# Altium project medusa-AI.PrjPCB
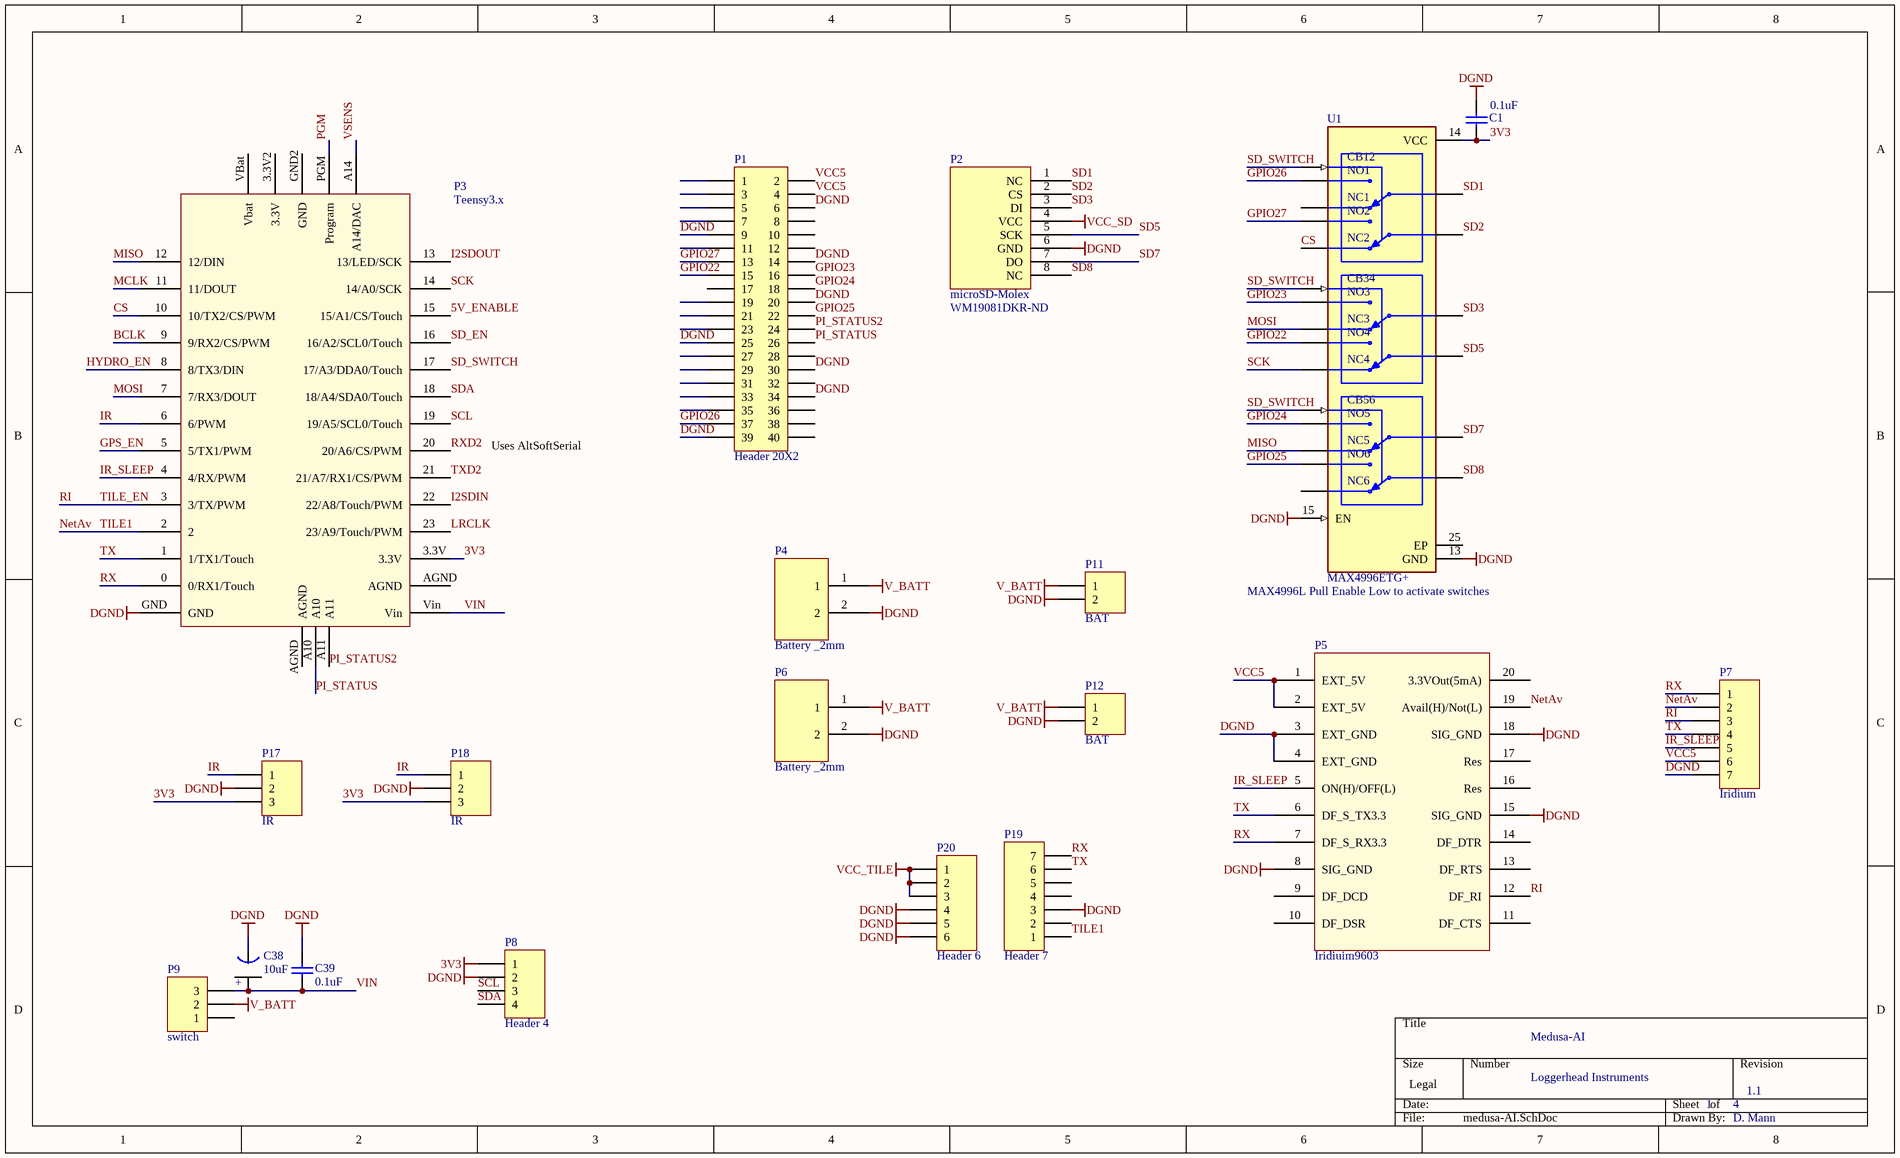
[diagram p0: medusa-AI.SchDoc]
4 sheets, 75 parts. Net scope: global (net labels, ports and power ports of the same name join across sheets).
Board file: medusa-AI.PcbDoc
Sheets:
  medusa-AI.SchDoc
  medusa-AI-audio.SchDoc
  medusa-AI-sensors.SchDoc
  medusa-AI-power.SchDoc

## Sheet medusa-AI.SchDoc
size Legal

### Parts
C1  0.1uF  [0402]
C38  10uF  [Tant0805]
C39  0.1uF  [0402]
P1  Header 20X2  [HDR2X20]
P2  microSD-Molex  Supplier Part Number 1: WM19081DKR-ND  [microSD_Molex_hinged]
P3  Teensy3.x  [Teensy3.x]
P4  Battery _2mm  [HDR_2x1_2mm]
P5  Iridiuim9603  [Iridium9603]
P6  Battery _2mm  [HDR_2x1_2mm]
P7  Iridium  [HDR1X7]
P8  Header 4  [HDR1X4]
P9  switch  [HDR1X3]
P11  BAT  [HDR1X2]
P12  BAT  [HDR1X2]
P17  IR  [HDR1X3]
P18  IR  [HDR1X3]
P19  Header 7  [HDR1X7]
P20  Header 6  [HDR1X6]
U1  MAX4996ETG+  [QFN40P350X350X80-25N]

### Nets
3V3: C1.1 P3.3.3V P8.1 P17.3 P18.3 U1.14(VCC)
DGND: C1.2 C38.1(GND) C39.2 P1.6 P1.9 P1.14 P1.20 P1.25 P1.30 P1.34 P1.39 P2.6(GND) P3.GND P4.2 P5.3(EXT_GND) P5.4(EXT_GND) P5.8(SIG_GND) P5.15(SIG_GND) P5.18(SIG_GND) P6.2 P7.7 P8.2 P11.2 P12.2 P17.2 P18.2 P19.3 P20.4 P20.5 P20.6 U1.13(GND) U1.15(EN)
V_BATT: P4.1 P6.1 P9.2 P11.1 P12.1
VCC_SD: P2.4(VCC)
VCC_TILE: P20.1 P20.2 P20.3
VIN: C38.2(+) C39.1 P3.Vin P9.3
5V_ENABLE: P3.15(15/A1/CS/Touch)
BCLK: P3.9(9/RX2/CS/PWM)
CS: P3.10(10/TX2/CS/PWM) U1.11(NC2)
GPIO22: P1.15 U1.22(NO4)
GPIO23: P1.16 U1.21(NO3)
GPIO24: P1.18 U1.23(NO5)
GPIO25: P1.22 U1.24(NO6)
GPIO26: P1.37 U1.19(NO1)
GPIO27: P1.13 U1.20(NO2)
GPS_EN: P3.5(5/TX1/PWM)
HYDRO_EN: P3.8(8/TX3/DIN)
I2SDIN: P3.22(22/A8/Touch/PWM)
I2SDOUT: P3.13(13/LED/SCK)
IR: P3.6(6/PWM) P17.1 P18.1
IR_SLEEP: P3.4(4/RX/PWM) P5.5(ON(H)/OFF(L)) P7.5
LRCLK: P3.23(23/A9/Touch/PWM)
MCLK: P3.11(11/DOUT)
MISO: P3.12(12/DIN) U1.8(NC5)
MOSI: P3.7(7/RX3/DOUT) U1.10(NC3)
NetAv: P3.2 P5.19(Avail(H)/Not(L)) P7.2 P19.1  [also labelled TILE1]
PGM: P3.PGM(Program)
PI_STATUS: P1.26 P3.A10
PI_STATUS2: P1.24 P3.A11
RI: P3.3(3/TX/PWM) P5.12(DF_RI) P7.3  [also labelled TILE_EN]
RX: P3.0(0/RX1/Touch) P5.7(DF_S_RX3.3) P7.1 P19.7
RXD2: P3.20(20/A6/CS/PWM)
SCK: P3.14(14/A0/SCK) U1.9(NC4)
SCL: P3.19(19/A5/SCL0/Touch) P8.3
SD1: P2.1(NC) U1.18(COM1)
SD2: P2.2(CS) U1.17(COM2)
SD3: P2.3(DI) U1.16(COM3)
SD5: P2.5(SCK) U1.4(COM4)
SD7: P2.7(DO) U1.5(COM5)
SD8: P2.8(NC) U1.6(COM6)
SD_EN: P3.16(16/A2/SCL0/Touch)
SD_SWITCH: P3.17(17/A3/DDA0/Touch) U1.1(CB12) U1.2(CB34) U1.3(CB56)
SDA: P3.18(18/A4/SDA0/Touch) P8.4
TX: P3.1(1/TX1/Touch) P5.6(DF_S_TX3.3) P7.4 P19.6
TXD2: P3.21(21/A7/RX1/CS/PWM)
VCC5: P1.2 P1.4 P5.1(EXT_5V) P5.2(EXT_5V) P7.6
VSENS: P3.A14(A14/DAC)

Not connected (* = marked no-connect by the designer): P1 1 3 5 7 8 10 11 12 17 19 21 23 27 28 29 31 32 33 35 36 38 40; P3 3.3V2(3.3V) AGND GND2(GND) VBat(Vbat); P5 9(DF_DCD) 10(DF_DSR) 11(DF_CTS) 13(DF_RTS) 14(DF_DTR) 16(Res) 17(Res) 20(3.3VOut(5mA)); P9 1; P19 2 4 5; U1 7(NC6) 12(NC1) 25(EP)

### Notes on the sheet
- Uses AltSoftSerial
- (near U1) MAX4996L Pull Enable Low to activate switches
- Medusa-AI
- Loggerhead Instruments
- 1
- 4
- 1.1
- D. Mann

### Library data of the parts
C1 C39 = C0402: Ceramic Chip Capacitor - Standard; Note: Footprint corresponds to dimensions for bulk cassette packaging. This case size has tightened tolerances.; Published: 17-Jul-2002; LatestRevisionDate: 19-Mar-2004; LatestRevisionNote: Silkscreen size reduced.; DatasheetDocument: Mar-2001; PackageDocument: Mar-2001; PackageReference: 0402; Publisher: Altium Limited; Code_JEITA: 0402; Code_IPC: 1005 [0402]; ComponentLink1Description: Manufacturer Link; ComponentLink1URL: http://www.kemet.com/; ComponentLink2Description: Datasheet; ComponentLink2URL: http://www.kemet.com/kemet/web/homepage/kechome.nsf/vapubfilesname/F3102TA.pdf/$file/F3102TA.pdf; Value: 0.1uF
C38 = Tant0805: Value: 10uF
P1 = Header 20X2: Header, 20-Pin, Dual row; LatestRevisionDate: 17-Jul-2002; LatestRevisionNote: Re-released for DXP Platform.; Publisher: Altium Limited
P2 = microSD_Molex_hinged: Supplier 1: Digi-Key
P4 P6 = HDR_2x1_2mm: Charging Connector
P5 = IRIDIUM9603
P7 P19 = Header 7: Header, 7-Pin; LatestRevisionDate: 17-Jul-2002; LatestRevisionNote: Re-released for DXP Platform.; Publisher: Altium Limited
P8 = Header 4: Header, 4-Pin; LatestRevisionDate: 17-Jul-2002; LatestRevisionNote: Re-released for DXP Platform.; Publisher: Altium Limited
P9 P17 P18 = Header 3: Header, 3-Pin; LatestRevisionDate: 17-Jul-2002; LatestRevisionNote: Re-released for DXP Platform.; Publisher: Altium Limited
P11 P12 = Header 2: Header, 2-Pin; LatestRevisionDate: 17-Jul-2002; LatestRevisionNote: Re-released for DXP Platform.; Publisher: Altium Limited
P20 = Header 6: Header, 6-Pin; LatestRevisionDate: 17-Jul-2002; LatestRevisionNote: Re-released for DXP Platform.; Publisher: Altium Limited
U1 = MAX4996ETG+: 3 Circuit IC Switch 2:2 4Ohm 24-TQFN (4x4); MF: Maxim Integrated; SnapEDA_Link: https://www.snapeda.com/parts/MAX4996ETG+/Maxim%20Integrated/view-part/1193961/?ref=snap; Value: *; Purchase-URL: https://pricing.snapeda.com/search/part/MAX4996ETG+/?ref=eda; Price: None; Availability: Warning; Check_prices: https://www.snapeda.com/parts/MAX4996ETG+/Maxim%20Integrated/view-part/1193961/?ref=eda; MP: MAX4996ETG+; Package: TQFN-24 Maxim

## Sheet medusa-AI-audio.SchDoc
size A
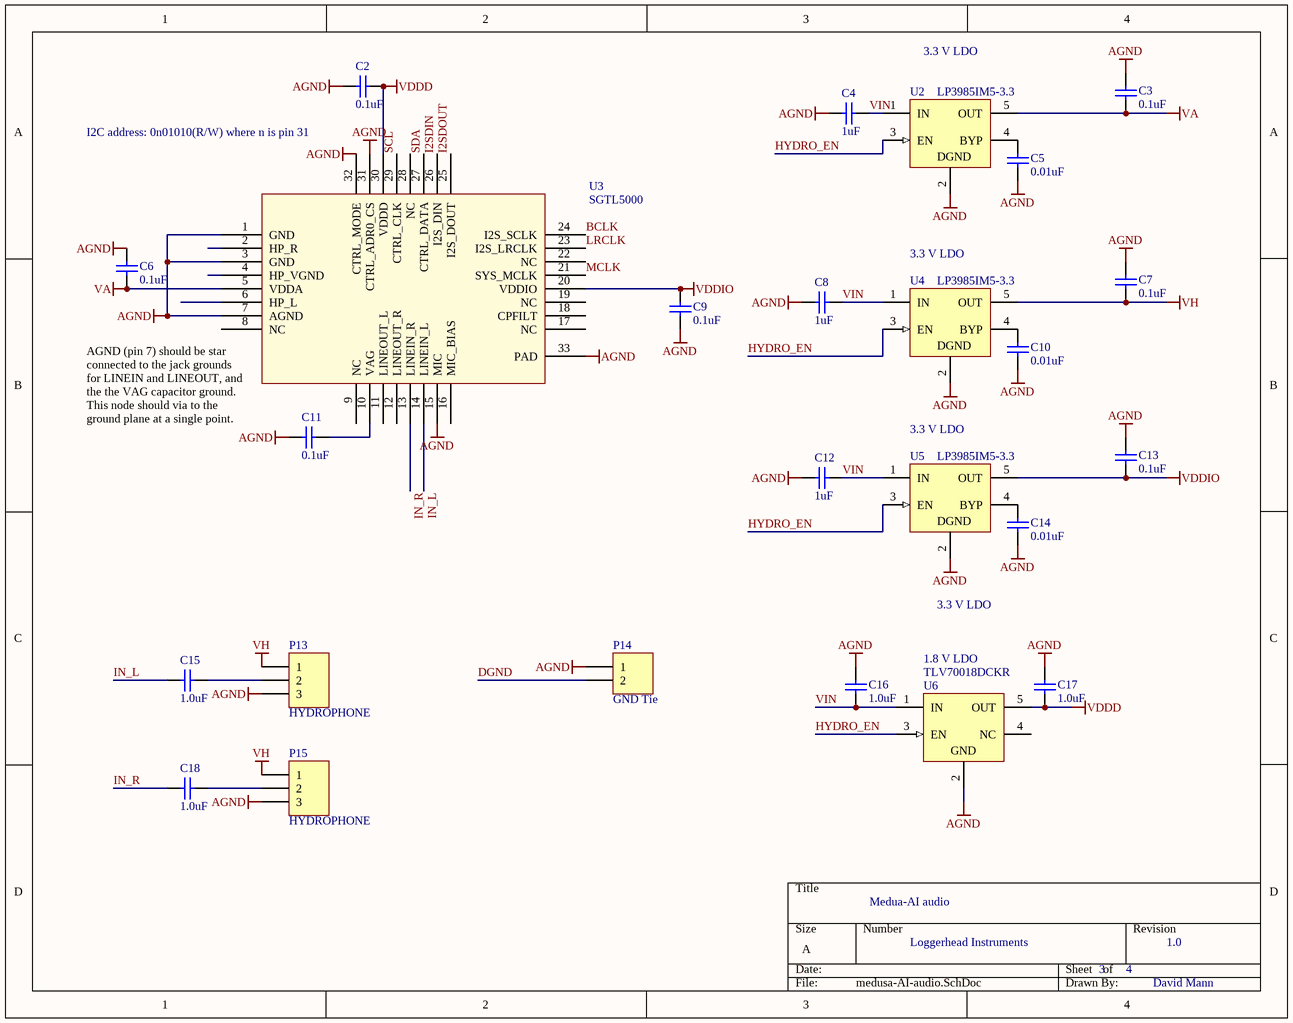
[diagram p1: medusa-AI-audio.SchDoc]

### Parts
C2  0.1uF  [0402]
C3  0.1uF  [0402]
C4  1uF  [0402]
C5  0.01uF  [0402]
C6  0.1uF  [0402]
C7  0.1uF  [0402]
C8  1uF  [0402]
C9  0.1uF  [0402]
C10  0.01uF  [0402]
C11  0.1uF  [0402]
C12  1uF  [0402]
C13  0.1uF  [0402]
C14  0.01uF  [0402]
C15  1.0uF  [0402]
C16  1.0uF  [0402]
C17  1.0uF  [0402]
C18  1.0uF  [0402]
P13  HYDROPHONE  [HDR1X3]
P14  GND Tie  [HDR1X2]
P15  HYDROPHONE  [HDR1X3]
U2  LP3985IM5-3.3  [MF05A_N]
U3  SGTL5000  [QFN32]
U4  LP3985IM5-3.3  [MF05A_N]
U5  LP3985IM5-3.3  [MF05A_N]
U6  TLV70018DCKR  [TI-DCK5_V]

### Nets
AGND: C2.2 C3.2 C4.2 C5.2 C6.2 C7.2 C8.2 C9.2 C10.2 C11.2 C12.2 C13.2 C14.2 C16.2 C17.2 P13.3 P14.1 P15.3 U2.2(GND) U3.1(GND) U3.3(GND) U3.7(AGND) U3.15(MIC) U3.31(CTRL_ADR0_CS) U3.32(CTRL_MODE) U3.33(PAD) U4.2(GND) U5.2(GND) U6.2(GND)
DGND: P14.2
VA: C3.1 C6.1 U2.5(OUT) U3.5(VDDA)
VDDD: C2.1 C17.1 U3.30(VDDD) U6.5(OUT)
VDDIO: C9.1 C13.1 U3.20(VDDIO) U5.5(OUT)
VH: C7.1 P13.1 P15.1 U4.5(OUT)
VIN: C4.1 C8.1 C12.1 C16.1 U2.1(IN) U4.1(IN) U5.1(IN) U6.1(IN)
BCLK: U3.24(I2S_SCLK)
HYDRO_EN: U2.3(EN) U4.3(EN) U5.3(EN) U6.3(EN)
I2SDIN: U3.26(I2S_DIN)
I2SDOUT: U3.25(I2S_DOUT)
IN_L: C15.2 U3.14(LINEIN_L)
IN_R: C18.2 U3.13(LINEIN_R)
LRCLK: U3.23(I2S_LRCLK)
MCLK: U3.21(SYS_MCLK)
SCL: U3.29(CTRL_CLK)
SDA: U3.27(CTRL_DATA)
NetC5_1: C5.1 U2.4(BYP)
NetC10_1: C10.1 U4.4(BYP)
NetC11_1: C11.1 U3.10(VAG)
NetC14_1: C14.1 U5.4(BYP)
NetC15_1: C15.1 P13.2
NetC18_1: C18.1 P15.2

Not connected (* = marked no-connect by the designer): U3 2(HP_R) 4(HP_VGND) 6(HP_L) 8(NC) 9(NC) 11(LINEOUT_L) 12(LINEOUT_R) 16(MIC_BIAS) 17(NC) 18(CPFILT) 19(NC) 22(NC) 28(NC); U6 4(NC)

### Notes on the sheet
- 3.3 V LDO
- I2C address: 0n01010(R/W) where n is pin 31
- (near U4) 3.3 V LDO
- (near U3) AGND (pin 7) should be star connected to the jack grounds for LINEIN and LINEOUT, and the the VAG capacitor ground. This node should via to the ground plane at a single point.
- (near U5) 3.3 V LDO
- (near U6) 1.8 V LDO
- Medua-AI audio
- Loggerhead Instruments
- 3
- 4
- 1.0
- David Mann
- (in symbol LP3985IM5-3.3) DGND

### Library data of the parts
C2 C3 C6 C7 C9 C11 C13 = C0402: as C1 on sheet medusa-AI; Published: 17-Jul-2002; LatestRevisionDate: 19-Mar-2004; LatestRevisionNote: Silkscreen size reduced.; DatasheetDocument: Mar-2001; PackageDocument: Mar-2001; PackageReference: 0402; Publisher: Altium Limited; Code_JEITA: 0402; Code_IPC: 1005 [0402]; ComponentLink1Description: Manufacturer Link; ComponentLink1URL: http://www.kemet.com/; ComponentLink2Description: Datasheet; ComponentLink2URL: http://www.kemet.com/kemet/web/homepage/kechome.nsf/vapubfilesname/F3102TA.pdf/$file/F3102TA.pdf; Value: 0.1uF
C4 C5 C8 C10 C12 C14-C18 = C0402: Ceramic Chip Capacitor - Standard; Note: Footprint corresponds to dimensions for bulk cassette packaging. This case size has tightened tolerances.; Value: 0.1uF; Published: 17-Jul-2002; LatestRevisionDate: 19-Mar-2004; LatestRevisionNote: Silkscreen size reduced.; DatasheetDocument: Mar-2001; PackageDocument: Mar-2001; PackageReference: 0402; Publisher: Altium Limited; Code_JEITA: 0402; Code_IPC: 1005 [0402]; ComponentLink1Description: Manufacturer Link; ComponentLink1URL: http://www.kemet.com/; ComponentLink2Description: Datasheet; ComponentLink2URL: http://www.kemet.com/kemet/web/homepage/kechome.nsf/vapubfilesname/F3102TA.pdf/$file/F3102TA.pdf
P13 P15 = Header 3: Header, 3-Pin; LatestRevisionDate: 17-Jul-2002; LatestRevisionNote: Re-released for DXP Platform.; Publisher: Altium Limited
P14 = Header 2: Header, 2-Pin; LatestRevisionDate: 17-Jul-2002; LatestRevisionNote: Re-released for DXP Platform.; Publisher: Altium Limited
U2 U4 U5 = LP3985IM5-3.3: Micropower, 150mA Low-Noise Ultra Low-Dropout CMOS Voltage Regulator; Manufacturer: National Semiconductor; CompType: LDO IC; PackageTopMarking: LDQB*XTT; PowerWise: N; Published: 4-Dec-2008; DatasheetVersion: Aug-2005; PackageVersion: revD, Aug-2008; PackageReference: MF05A; Publisher: Altium Limited; PackageDescription: Molded SOT-23, .115 x .063 x .040 in Body, 5 Lead, .0375 in Pitch; PartNumber: LP3985IM5-3.3; RoHS: O; PinCount: 5; DigiKeyPartNumber: LP3985IM5-3.3CT-ND; ComponentLink1Description: LP3985 Datasheet; ComponentLink1URL: http://www.national.com/ds/LP/LP3985.pdf; ComponentLink2Description: LP3985 Web Page; ComponentLink2URL: http://www.national.com/pf/LP/LP3985.html; ComponentLink3Description: MF05A Package Page; ComponentLink3URL: http://www.national.com/packaging/folders/mf05a.html
U6 = TLV70018DCKR: Single Output LDO, 200 mA, Fixed 1.8 V Output, 2 to 5.5 V Input, with Low IQ, 5-pin SC70 (DCK), -40 to 125 degC, Green (RoHS & no Sb/Br); Manufacturer: Texas Instruments; Accuracy(%): 2; Fixed Output Options(V): 1.8; Iout(Max)(A): 0.2; Iq(Typ)(mA): 0.03; SubFamily: Single Channel LDO; Vdo(Typ)(mV): 175; Vin(Max)(V): 5.5; DatasheetVersion: SLVSA00D; PackageVersion: 4093553-3/G; PackageReference: DCK5; PackageDescription: 5-Pin Plastic Small-Outline, Body 2 x 1.25 mm, Pitch 0.65 mm; Supplier 1: Digi-Key; Supplier Part Number 1: 296-32409-2-ND; Supplier 2: Digi-Key; Supplier Part Number 2: 296-32409-1-ND; Supplier 3: Digi-Key; Supplier Part Number 3: 296-32409-6-ND; Supplier 4: Newark; Supplier Part Number 4: 55R7461; Supplier 5: Mouser; Supplier Part Number 5: 595-TLV70018DCKR; Eco-Plan: Green (RoHS & no Sb/Br); Vin(Min)(V): 2; Vout Adj(Max)(V): 1.8; Vout Adj(Min)(V): 1.8; Mounting Technology: Surface Mount; Code_JEDEC: MO-203; PartNumber: TLV70018DCKR; ComponentLink1Description: Manufacturer URL; ComponentLink1URL: http://www.ti.com/; ComponentLink2Description: Datasheet; ComponentLink2URL: http://www.ti.com/general/docs/lit/getliterature.tsp?genericPartNumber=TLV70018&fileType=pdf; ComponentLink3Description: Package Specification; ComponentLink3URL: http://www.ti.com/litv/pdf/mpds025f

## Sheet medusa-AI-sensors.SchDoc
size A
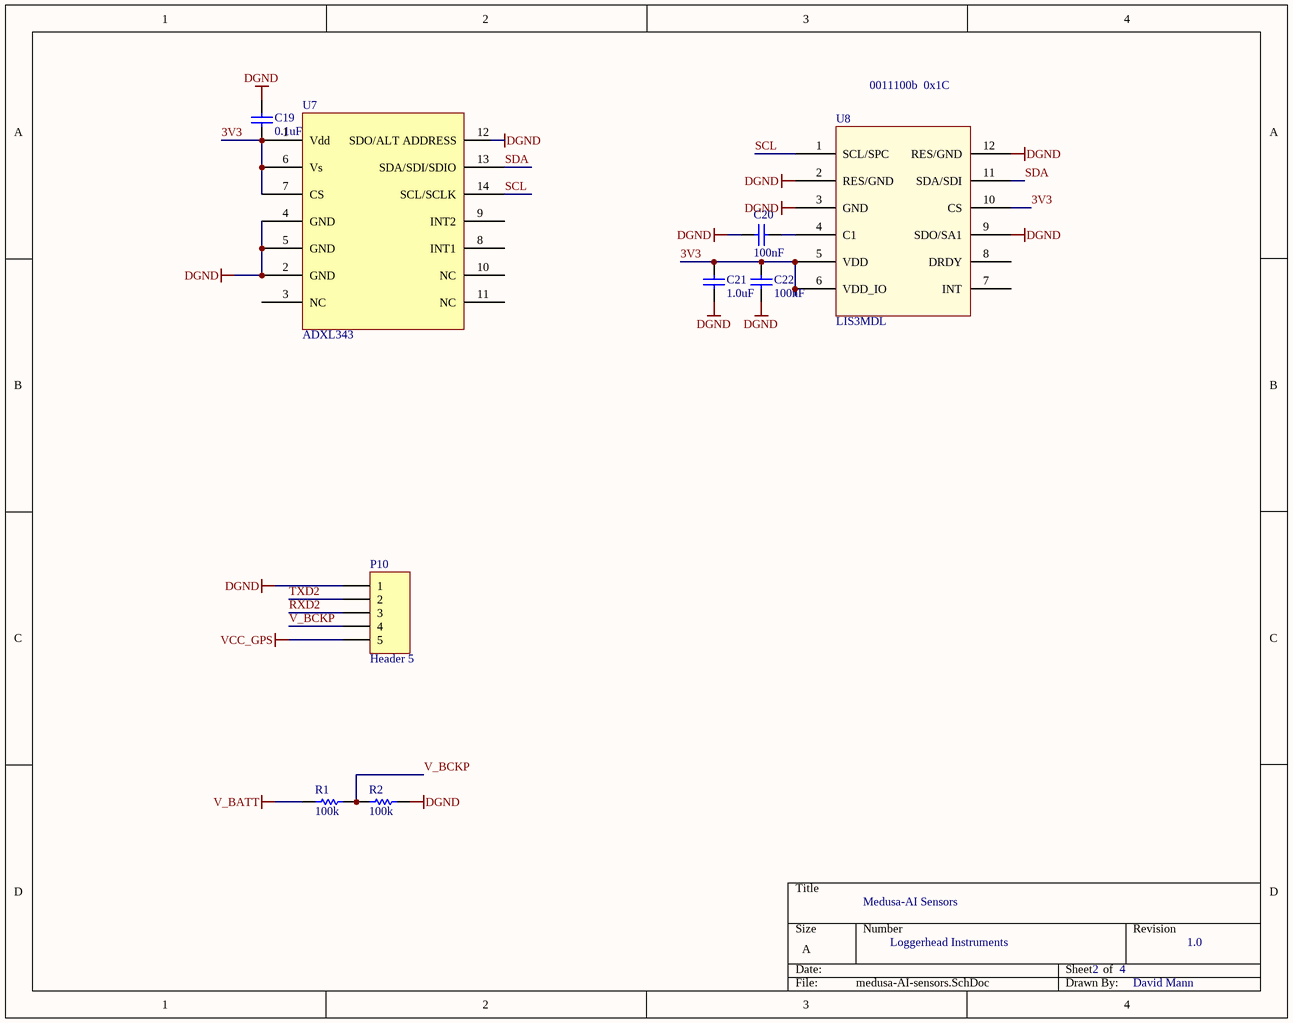
[diagram p2: medusa-AI-sensors.SchDoc]

### Parts
C19  0.1uF  [0402]
C20  100nF  [0402]
C21  1.0uF  [0402]
C22  100nF  [0402]
P10  Header 5  [HDR1X5]
R1  100k  [3-0603]
R2  100k  [3-0603]
U7  ADXL343  [ADXL345]
U8  LIS3MDL  [LGA-12]

### Nets
3V3: C19.1 C21.1 C22.1 U7.1(Vdd) U7.6(Vs) U7.7(CS) U8.5(VDD) U8.6(VDD_IO) U8.10(CS)
DGND: C19.2 C20.1 C21.2 C22.2 P10.1 R2.1 U7.2(GND) U7.4(GND) U7.5(GND) U7.12(SDO/ALT_ADDRESS) U8.2(RES/GND) U8.3(GND) U8.9(SDO/SA1) U8.12(RES/GND)
V_BATT: R1.2
VCC_GPS: P10.5
RXD2: P10.3
SCL: U7.14(SCL/SCLK) U8.1(SCL/SPC)
SDA: U7.13(SDA/SDI/SDIO) U8.11(SDA/SDI)
TXD2: P10.2
V_BCKP: P10.4 R1.1 R2.2
NetC20_2: C20.2 U8.4(C1)

Not connected (* = marked no-connect by the designer): U7 3(NC) 8(INT1) 9(INT2) 10(NC) 11(NC); U8 7(INT) 8(DRDY)

### Notes on the sheet
- 0011100b  0x1C
- Medusa-AI Sensors
- Loggerhead Instruments
- 2
- 4
- 1.0
- David Mann

### Library data of the parts
C19 C21 = C0402: as C1 on sheet medusa-AI; Published: 17-Jul-2002; LatestRevisionDate: 19-Mar-2004; LatestRevisionNote: Silkscreen size reduced.; DatasheetDocument: Mar-2001; PackageDocument: Mar-2001; PackageReference: 0402; Publisher: Altium Limited; Code_JEITA: 0402; Code_IPC: 1005 [0402]; ComponentLink1Description: Manufacturer Link; ComponentLink1URL: http://www.kemet.com/; ComponentLink2Description: Datasheet; ComponentLink2URL: http://www.kemet.com/kemet/web/homepage/kechome.nsf/vapubfilesname/F3102TA.pdf/$file/F3102TA.pdf
  C19: Value: 0.1uF
  C21: Value: 1.0uF
C20 C22 = C0402: Ceramic Chip Capacitor - Standard; Note: Footprint corresponds to dimensions for bulk cassette packaging. This case size has tightened tolerances.; Value: 1.0uF; Published: 17-Jul-2002; LatestRevisionDate: 19-Mar-2004; LatestRevisionNote: Silkscreen size reduced.; DatasheetDocument: Mar-2001; PackageDocument: Mar-2001; PackageReference: 0402; Publisher: Altium Limited; Code_JEITA: 0402; Code_IPC: 1005 [0402]; ComponentLink1Description: Manufacturer Link; ComponentLink1URL: http://www.kemet.com/; ComponentLink2Description: Datasheet; ComponentLink2URL: http://www.kemet.com/kemet/web/homepage/kechome.nsf/vapubfilesname/F3102TA.pdf/$file/F3102TA.pdf
P10 = Header 5: Header, 5-Pin; LatestRevisionDate: 17-Jul-2002; LatestRevisionNote: Re-released for DXP Platform.; Publisher: Altium Limited
R1 R2 = ERJ3RK: Precision Thick Film Chip Resistor, 10 Ohm to 1M Ohm Range, 1% and 0.5% Tolerance, 0603 Size, 0.063 W; Published: 17-Dec-2003; LatestRevisionDate: 19-Mar-2004; LatestRevisionNote: Silkscreen size reduced.; PackageDocument: Mar-2003; PackageReference: 3-0603; Publisher: Altium Limited; Code_IPC: 1608 [0603]; ComponentLink1Description: Manufacturer Link; ComponentLink1URL: http://www.panasonic.com/industrial/components/resistive_products.htm; ComponentLink2Description: Datasheet; ComponentLink2URL: http://www.panasonic.com/industrial/components/pdf/AOA0000CE2.pdf
U7 = ADXL345
U8 = LIS3MDL: magnetometer

## Sheet medusa-AI-power.SchDoc
size A
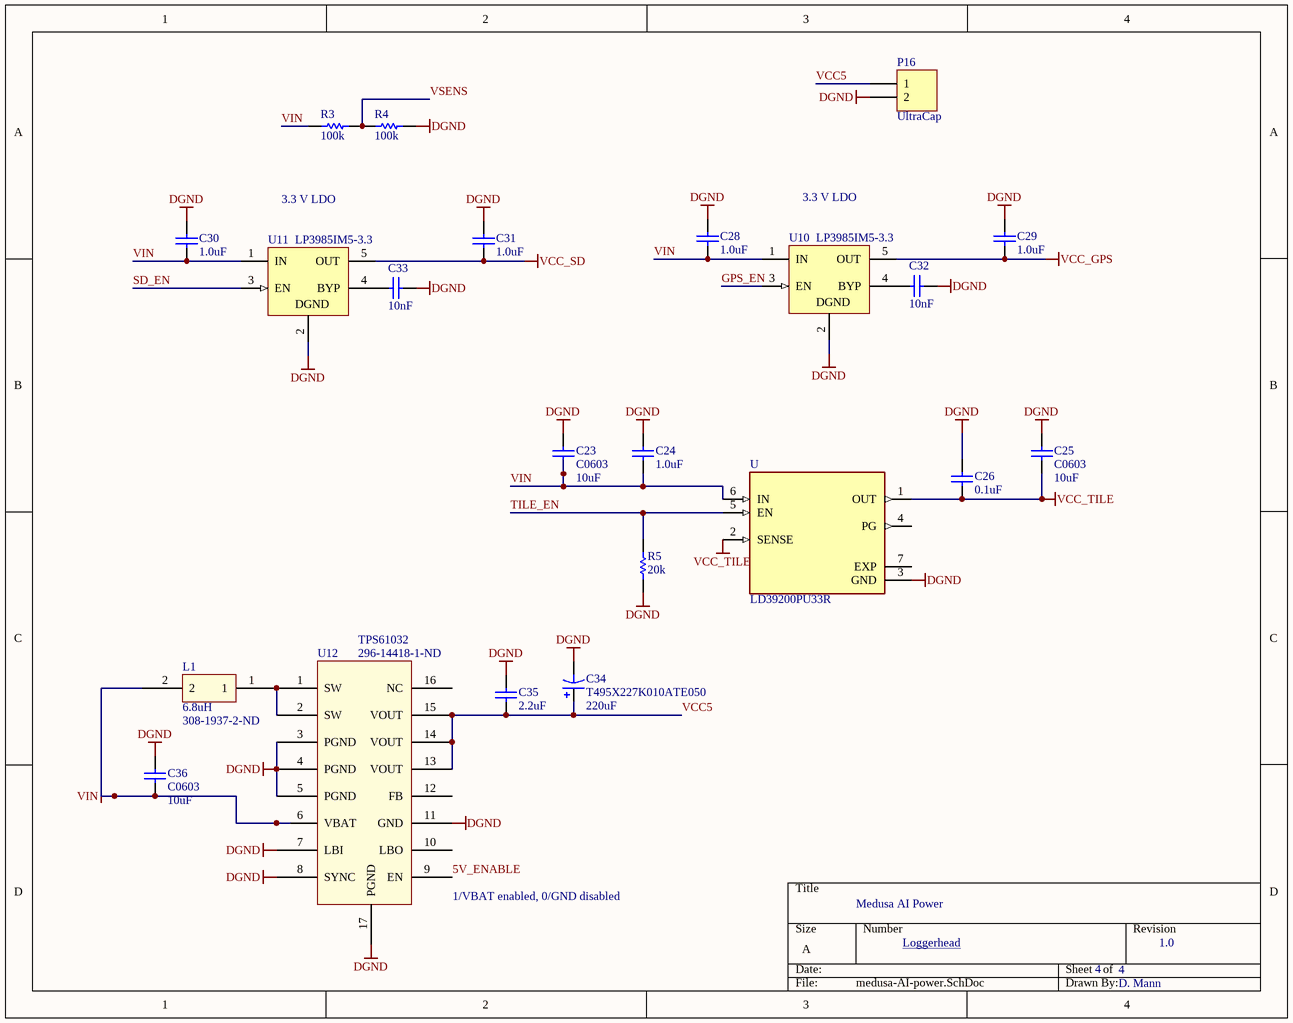
[diagram p3: medusa-AI-power.SchDoc]

### Parts
C23  C0603  value 10uF  [0603]
C24  1.0uF  [0402]
C25  C0603  value 10uF  [0603]
C26  0.1uF  [0402]
C28  1.0uF  [0402]
C29  1.0uF  [0402]
C30  1.0uF  [0402]
C31  1.0uF  [0402]
C32  10nF  [0402]
C33  10nF  [0402]
C34  T495X227K010ATE050  value 220uF  [X]
C35  2.2uF  [0402]
C36  C0603  value 10uF  [0603]
L1  6.8uH  Supplier Part Number 1: 308-1937-2-ND  [Inductor - duplicate]
P16  UltraCap  [HDR1X2]
R3  100k  [3-0603]
R4  100k  [3-0603]
R5  20k  [3-0603]
U  LD39200PU33R  [SON95P300X300X100-7N]
U10  LP3985IM5-3.3  [MF05A_N]
U11  LP3985IM5-3.3  [MF05A_N]
U12  TPS61032  Supplier Part Number 2: 296-14418-1-ND  [TPS6103x]

### Nets
DGND: C23.1 C24.2 C25.1 C26.2 C28.2 C29.2 C30.2 C31.2 C32.1 C33.1 C34.2 C35.2 C36.1 P16.2 R4.1 R5.2 U.3(GND) U10.2(GND) U11.2(GND) U12.3(PGND) U12.4(PGND) U12.5(PGND) U12.7(LBI) U12.8(SYNC) U12.11(GND) U12.17(PGND)
VCC_GPS: C29.1 U10.5(OUT)
VCC_SD: C31.1 U11.5(OUT)
VCC_TILE: C25.2 C26.1 U.1(OUT) U.2(SENSE)
VIN: C23.2 C24.1 C28.1 C30.1 C36.2 L1.2 R3.2 U.6(IN) U10.1(IN) U11.1(IN) U12.6(VBAT)
5V_ENABLE: U12.9(EN)
GPS_EN: U10.3(EN)
SD_EN: U11.3(EN)
TILE_EN: R5.1 U.5(EN)  [project net RI]
VCC5: C34.1 C35.1 P16.1 U12.13(VOUT) U12.14(VOUT) U12.15(VOUT)
VSENS: R3.1 R4.2
NetC32_2: C32.2 U10.4(BYP)
NetC33_2: C33.2 U11.4(BYP)
NetL1_1: L1.1 U12.1(SW) U12.2(SW)

Not connected (* = marked no-connect by the designer): U 4(PG) 7(EXP); U12 10(LBO) 12(FB) 16(NC)

### Notes on the sheet
- 3.3 V LDO
- (near U12) 1/VBAT enabled, 0/GND disabled
- Medusa AI Power
- Loggerhead
- 4
- 1.0
- D. Mann
- (in symbol LP3985IM5-3.3) DGND

### Library data of the parts
C23 C25 C36 = C0603: Ceramic Chip Capacitor - Standard; Note: Footprint corresponds to dimensions for bulk cassette packaging. This case size has tightened tolerances.; Published: 17-Jul-2002; LatestRevisionDate: 19-Mar-2004; LatestRevisionNote: Silkscreen size reduced.; DatasheetDocument: Mar-2001; PackageDocument: Mar-2001; PackageReference: 0603; Publisher: Altium Limited; Code_JEITA: 0603; Code_IPC: 1608 [0603]; ComponentLink1Description: Manufacturer Link; ComponentLink1URL: http://www.kemet.com/; ComponentLink2Description: Datasheet; ComponentLink2URL: http://www.kemet.com/kemet/web/homepage/kechome.nsf/vapubfilesname/F3102TA.pdf/$file/F3102TA.pdf
C24 C28-C33 = C0402: as C4 on sheet medusa-AI-audio; Published: 17-Jul-2002; LatestRevisionDate: 19-Mar-2004; LatestRevisionNote: Silkscreen size reduced.; DatasheetDocument: Mar-2001; PackageDocument: Mar-2001; PackageReference: 0402; Publisher: Altium Limited; Code_JEITA: 0402; Code_IPC: 1005 [0402]; ComponentLink1Description: Manufacturer Link; ComponentLink1URL: http://www.kemet.com/; ComponentLink2Description: Datasheet; ComponentLink2URL: http://www.kemet.com/kemet/web/homepage/kechome.nsf/vapubfilesname/F3102TA.pdf/$file/F3102TA.pdf
C26 C35 = C0402: as C1 on sheet medusa-AI; Published: 17-Jul-2002; LatestRevisionDate: 19-Mar-2004; LatestRevisionNote: Silkscreen size reduced.; DatasheetDocument: Mar-2001; PackageDocument: Mar-2001; PackageReference: 0402; Publisher: Altium Limited; Code_JEITA: 0402; Code_IPC: 1005 [0402]; ComponentLink1Description: Manufacturer Link; ComponentLink1URL: http://www.kemet.com/; ComponentLink2Description: Datasheet; ComponentLink2URL: http://www.kemet.com/kemet/web/homepage/kechome.nsf/vapubfilesname/F3102TA.pdf/$file/F3102TA.pdf
  C26: Value: 0.1uF
  C35: Value: 2.2uF
C34 = T495X: Solid Tantalum Chip Capacitor, Standard T495 Series - Low ESR, Surge Robust; PCB_Layout: Round Glue Pad at 2.9 ±0.1mm in diameter at KEMET's option; Published: 17-Jul-2002; LatestRevisionDate: 19-Mar-2004; LatestRevisionNote: Silkscreen dimensions re-sized.; DatasheetDocument: Mar-2001; PackageDocument: Mar-2001; PackageReference: X; Publisher: Altium Limited; Code_JEITA: 7343-43; ComponentLink1Description: Manufacturer Link; ComponentLink1URL: http://www.kemet.com/; ComponentLink2Description: Datasheet; ComponentLink2URL: http://www.kemet.com/kemet/web/homepage/kechome.nsf/vapubfilesname/F3102TA.pdf/$file/F3102TA.pdf
L1 = Inductor 6.8uH: Sumida Inductor; Supplier 1: Digi-Key
P16 = Header 2: Header, 2-Pin; LatestRevisionDate: 17-Jul-2002; LatestRevisionNote: Re-released for DXP Platform.; Publisher: Altium Limited
R3-R5 = ERJ3RK: as R1 on sheet medusa-AI-sensors; Published: 17-Dec-2003; LatestRevisionDate: 19-Mar-2004; LatestRevisionNote: Silkscreen size reduced.; PackageDocument: Mar-2003; PackageReference: 3-0603; Publisher: Altium Limited; Code_IPC: 1608 [0603]; ComponentLink1Description: Manufacturer Link; ComponentLink1URL: http://www.panasonic.com/industrial/components/resistive_products.htm; ComponentLink2Description: Datasheet; ComponentLink2URL: http://www.panasonic.com/industrial/components/pdf/AOA0000CE2.pdf
U = LD39200PU33R: Linear Voltage Regulator IC 1 Output 2A 6-DFN _3x3_; MF: STMicroelectronics; Package: DFN-6 STMicroelectronics; SnapEDA_Link: https://www.snapeda.com/parts/LD39200PU33R/STMicroelectronics/view-part/482679/?ref=snap; MP: LD39200PU33R; Value: *; Availability: Unavailable; Price: None
U10 U11 = LP3985IM5-3.3: as U2 on sheet medusa-AI-audio; Published: 4-Dec-2008; DatasheetVersion: Aug-2005; PackageVersion: revD, Aug-2008; PackageReference: MF05A; Publisher: Altium Limited; PackageDescription: Molded SOT-23, .115 x .063 x .040 in Body, 5 Lead, .0375 in Pitch; PartNumber: LP3985IM5-3.3; RoHS: O; PinCount: 5; DigiKeyPartNumber: LP3985IM5-3.3CT-ND; ComponentLink1Description: LP3985 Datasheet; ComponentLink1URL: http://www.national.com/ds/LP/LP3985.pdf; ComponentLink2Description: LP3985 Web Page; ComponentLink2URL: http://www.national.com/pf/LP/LP3985.html; ComponentLink3Description: MF05A Package Page; ComponentLink3URL: http://www.national.com/packaging/folders/mf05a.html
U12 = TPS6103x: Boost converter; Supplier 1: Newark; Supplier 2: Digi-Key

## Nets that join several sheets
3V3: medusa-AI (6 pins), medusa-AI-sensors (9 pins)
DGND: medusa-AI (32 pins), medusa-AI-audio (P14.2), medusa-AI-sensors (14 pins), medusa-AI-power (26 pins)
V_BATT: medusa-AI (5 pins), medusa-AI-sensors (R1.2)
VCC_GPS: medusa-AI-sensors (P10.5), medusa-AI-power (C29.1 U10.5)
VCC_SD: medusa-AI (P2.4), medusa-AI-power (C31.1 U11.5)
VCC_TILE: medusa-AI (P20.1 P20.2 P20.3), medusa-AI-power (C25.2 C26.1 U.1 U.2)
VIN: medusa-AI (C38.2 C39.1 P3.Vin P9.3), medusa-AI-audio (8 pins), medusa-AI-power (11 pins)
5V_ENABLE: medusa-AI (P3.15), medusa-AI-power (U12.9)
BCLK: medusa-AI (P3.9), medusa-AI-audio (U3.24)
GPS_EN: medusa-AI (P3.5), medusa-AI-power (U10.3)
HYDRO_EN: medusa-AI (P3.8), medusa-AI-audio (U2.3 U4.3 U5.3 U6.3)
I2SDIN: medusa-AI (P3.22), medusa-AI-audio (U3.26)
I2SDOUT: medusa-AI (P3.13), medusa-AI-audio (U3.25)
LRCLK: medusa-AI (P3.23), medusa-AI-audio (U3.23)
MCLK: medusa-AI (P3.11), medusa-AI-audio (U3.21)
RI: medusa-AI (P3.3 P5.12 P7.3), medusa-AI-power (R5.1 U.5)
RXD2: medusa-AI (P3.20), medusa-AI-sensors (P10.3)
SCL: medusa-AI (P3.19 P8.3), medusa-AI-audio (U3.29), medusa-AI-sensors (U7.14 U8.1)
SD_EN: medusa-AI (P3.16), medusa-AI-power (U11.3)
SDA: medusa-AI (P3.18 P8.4), medusa-AI-audio (U3.27), medusa-AI-sensors (U7.13 U8.11)
TXD2: medusa-AI (P3.21), medusa-AI-sensors (P10.2)
VCC5: medusa-AI (5 pins), medusa-AI-power (6 pins)
VSENS: medusa-AI (P3.A14), medusa-AI-power (R3.1 R4.2)